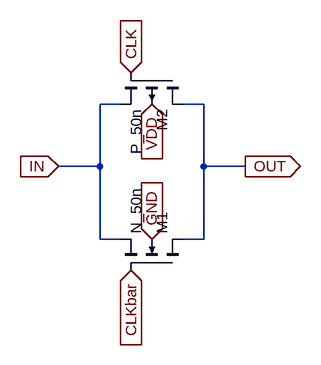
[diagram p0: schematic TG.asc]
TG.asc, the LTspice schematic file:
Version 4.1
SHEET 1 880 680
WIRE 400 112 368 112
WIRE 528 112 496 112
WIRE 368 208 368 112
WIRE 368 208 304 208
WIRE 528 208 528 112
WIRE 592 208 528 208
WIRE 368 320 368 208
WIRE 400 320 368 320
WIRE 528 320 528 208
WIRE 528 320 496 320
FLAG 448 112 VDD
IOPIN 448 112 In
FLAG 448 320 GND
IOPIN 448 320 In
FLAG 304 208 IN
IOPIN 304 208 In
FLAG 592 208 OUT
IOPIN 592 208 Out
FLAG 416 64 CLK
IOPIN 416 64 In
FLAG 416 368 CLKbar
IOPIN 416 368 In
SYMBOL nmos4 496 368 M270
SYMATTR InstName M1
SYMATTR Value2 l=50n w=2u
SYMATTR Value N_50n
SYMBOL pmos4 496 64 R90
SYMATTR InstName M2
SYMATTR Value2 l=50n w=6u
SYMATTR Value P_50n

The netlist it stands for:
* TG.asc
M1 OUT CLKbar IN GND N_50n l=50n w=2u
M2 OUT CLK IN VDD P_50n l=50n w=6u
.model NMOS NMOS
.model PMOS PMOS
.lib standard.mos
.backanno
.end